# EasyEDA Pro project Jalousee PCB.eprj, schematic Jalousee PCB
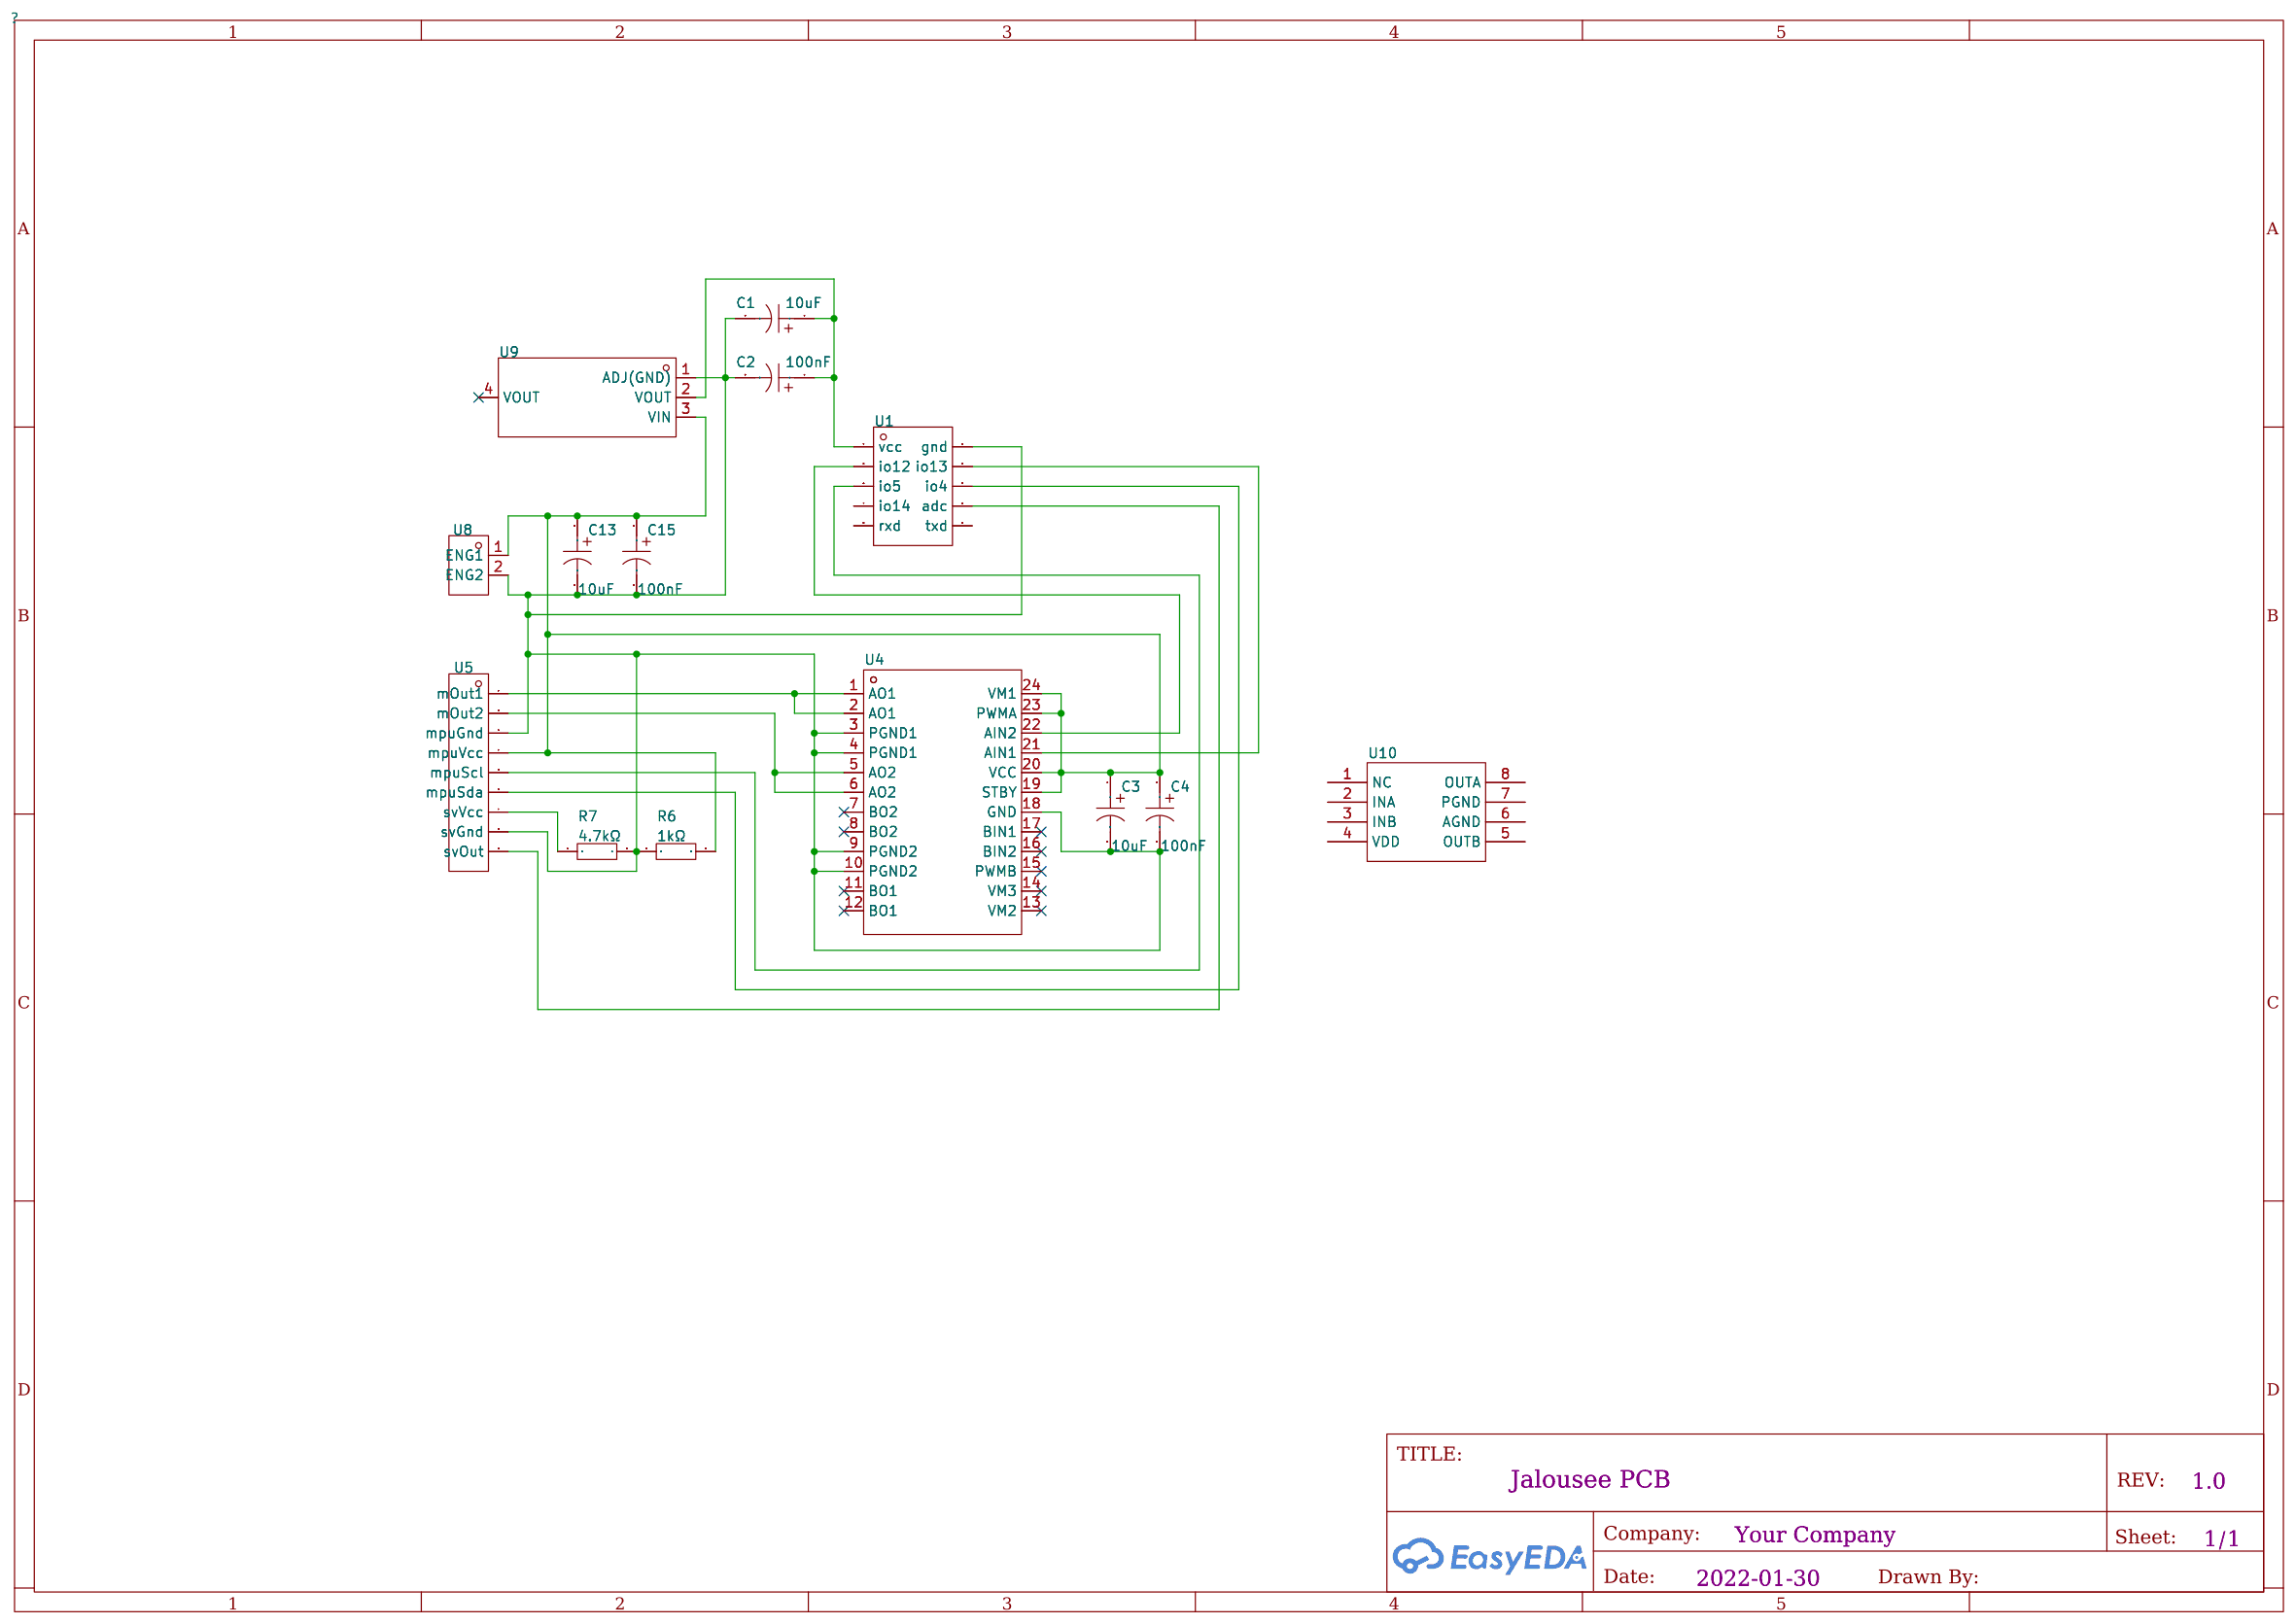
[diagram p0: schematic sheet]

## Parts
C1  10uF  [CAP-SMD_L2.0-W1.3-FD]
C2  100nF  [CAP-SMD_L3.2-W1.6-FD]
C3  10uF  [CAP-SMD_L2.0-W1.3-FD]
C4  100nF  [CAP-SMD_L3.2-W1.6-FD]
C13  10uF  [CAP-SMD_L2.0-W1.3-FD]
C15  100nF  [CAP-SMD_L3.2-W1.6-FD]
R6  1kΩ  [R0402]
R7  4.7kΩ  [R0402]
U1  -  [CONN-TH_10P-P2.54_DEALON_DW254R-22-10-85]
U4  -  [SSOP-24_L8.3-W5.6-P0.65-LS7.6-BL]
U5  -  [HDR-TH_9P-P2.54-V-F]
U8  -  [HDR-TH_2P-P2.54-V-F]
U9  -  [SOT-223-3_L6.5-W3.4-P2.30-LS7.0-BR]
U10  -  [SOP-8_L4.9-W3.9-P1.27-LS6.0-BL]

## Library data of the parts
C1 C3 C13 = CA45-P-6.3V-10UF-K: Capacitance: Tolerance:±10% Tolerance:±10% Rated Voltage: Leakage Current(DCL):- Ripple Current:- Equivalent Series Resistance(ESR):-; LCSC Part Name: 10uF ±10% 6.3V; Supplier Part: C2844395; Manufacturer: CEC(振华新云); Supplier Footprint: CASE-P_2012; JLCPCB Part Class: Extended Part; Datasheet: https://atta.szlcsc.com/upload/public/pdf/source/20210702/C2844395_E7EBF1B65FEA8FC3CE954A9FCB08EE3D.pdf; Supplier: LCSC; Tolerance: ±10%
C2 C4 C15 = T491A104M050AT: Capacitance:100nF Tolerance:±20% Tolerance:±20% Rated Voltage:50V Leakage Current(DCL):- Ripple Current:- Equivalent Series Resistance(ESR):20Ω Operating Temperature:-55~+125 Operating Temperature:-55~+125; LCSC Part Name: 100nF ±20% 50V; Supplier Part: C1952859; Manufacturer: KEMET(基美); Supplier Footprint: 1206; JLCPCB Part Class: Extended Part; Datasheet: https://atta.szlcsc.com/upload/public/pdf/source/20210416/95C0EC5B3581C9A90529545117ABEAC1.pdf; Supplier: LCSC; Tolerance: ±20%; Rated Voltage: 50V; Equivalent Series Resistance(ESR): 20Ω; Operating Temperature: -55~+125
R6 = RC0402FR-071KL: Type:厚膜电阻 Resistance:1kΩ Tolerance:±1% Power(Watts):62.5mW Temperature Coefficient:±100ppm/ Temperature Coefficient:±100ppm/ Overload Voltage (Max):50V Operating Temperature Range:-55~+155 Operating Temperature Range:-55~+155; LCSC Part Name: 1kΩ ±1%; Supplier Part: C106235; Manufacturer: YAGEO(国巨); Supplier Footprint: 0402; JLCPCB Part Class: Extended Part; Datasheet: https://atta.szlcsc.com/upload/public/pdf/source/20170518/1495085714666.pdf; Supplier: LCSC; Type: 厚膜电阻; Tolerance: ±1%; Power(Watts): 62.5mW; Temperature Coefficient: ±100ppm/; Overload Voltage (Max): 50V; Operating Temperature Range: -55~+155
R7 = RC0402FR-074K7L: Resistance: Tolerance:±1% Tolerance:±1% Power(Watts): Temperature Coefficient:±100ppm/ Temperature Coefficient:±100ppm/ Overload Voltage (Max): Operating Temperature Range:-55~+155 Operating Temperature Range:-55~+155; LCSC Part Name: 4.7kΩ ±1% 62.5mW; Supplier Part: C105871; Manufacturer: YAGEO(国巨); Supplier Footprint: 0402; JLCPCB Part Class: Extended Part; Datasheet: https://atta.szlcsc.com/upload/public/pdf/source/20170912/C105871_1505207463959963228.pdf; Supplier: LCSC; Tolerance: ±1%; Temperature Coefficient: ±100ppm/; Operating Temperature Range: -55~+155
U1 = DW254R-22-10-85: Pitch:2.54mm Number of Holes:10 Number of Rows:2 Holes Structure:2x5P Row Spacing:2.54mm Mounting Type:直插 Circular Hole / Square Hole:方孔 Current Rating (Max):3A Voltage Rating (Max):- Holes Direction:顶部 Insulation Height:8.5mm Operating Temperature Range:; LCSC Part Name: 2.54mm 2x5P; Supplier Part: C2935985; Manufacturer: DEALON(德艺隆); Supplier Footprint: 直插,P=2.54mm; JLCPCB Part Class: Extended Part; Datasheet: https://atta.szlcsc.com/upload/public/pdf/source/20211231/BFA45F732C9356EE88FA0C9F09D83196.pdf; Supplier: LCSC; Pitch: 2.54mm; Number of Holes: 10; Number of Rows: 2; Holes Structure: 2x5P; Row Spacing: 2.54mm; Mounting Type: 直插; Circular Hole / Square Hole: 方孔; Current Rating (Max): 3A; Holes Direction: 顶部; Insulation Height: 8.5mm
U4 = TB6612FNG,C,8,EL: Supplier Part: C141517; Manufacturer: TOSHIBA(东芝); Supplier Footprint: SSOP-24; JLCPCB Part Class: Extended Part; Datasheet: https://atta.szlcsc.com/upload/public/pdf/source/20171128/C141517_15118625624231147036.pdf; Supplier: LCSC
U5 = DM254R-11-09-85: Pitch:2.54mm Number of Holes:9 Number of Rows:1 Holes Structure:1x9P Row Spacing:- Mounting Type:直插 Circular Hole / Square Hole:方孔 Current Rating (Max):3A Voltage Rating (Max):- Holes Direction:顶部 Insulation Height:8.5mm Operating Temperature Range:- Oper; LCSC Part Name: 2.54mm 1x9P; Supplier Part: C2935980; Manufacturer: DEALON(德艺隆); Supplier Footprint: 直插,P=2.54mm; JLCPCB Part Class: Extended Part; Datasheet: https://atta.szlcsc.com/upload/public/pdf/source/20220110/4E97995FE1BF9788ECBB6F72A9540C3B.pdf; Supplier: LCSC; Pitch: 2.54mm; Number of Holes: 9; Number of Rows: 1; Holes Structure: 1x9P; Mounting Type: 直插; Circular Hole / Square Hole: 方孔; Current Rating (Max): 3A; Holes Direction: 顶部; Insulation Height: 8.5mm
U8 = DM254R-11-02-85: Pitch:2.54mm Number of Holes:2 Number of Rows:1 Holes Structure:1x2P Row Spacing:- Mounting Type:Straight Circular Hole / Square Hole:Square Holes Current Rating (Max):3A Voltage Rating (Max):- Holes Direction:Top Insulation Height:8.5mm Operating Tempera; LCSC Part Name: 2.54mm 1x2P 180度 Y型; Supplier Part: C2935973; Manufacturer: DEALON(德艺隆); Supplier Footprint: 直插,P=2.54mm; JLCPCB Part Class: Extended Part; Datasheet: https://atta.szlcsc.com/upload/public/pdf/source/20220110/4E97995FE1BF9788ECBB6F72A9540C3B.pdf; Supplier: LCSC; Pitch: 2.54mm; Number of Holes: 2; Number of Rows: 1; Holes Structure: 1x2P; Mounting Type: Straight; Circular Hole / Square Hole: Square Holes; Current Rating (Max): 3A; Holes Direction: Top; Insulation Height: 8.5mm
U9 = AMS1117-3.3: Output Type:固定 Output Polarity:正 Number of Outputs:1 Maximum Input Voltage:18V Output Voltage:3.3V Output Voltage:3.3V Dropout Voltage:1.3V@(1A) Output Current:1A Power Supply Rejection Ratio (PSRR):60dB@(120Hz) Operating Temperature:±150@(Tj) Operating; LCSC Part Name: Vin=18V Vout=3.3V 1A 60dB@(120Hz); Supplier Part: C2891839; Manufacturer: YONGYUTAI(永裕泰); Supplier Footprint: SOT-223; JLCPCB Part Class: Extended Part; Datasheet: https://atta.szlcsc.com/upload/public/pdf/source/20210901/A75ADDE6A17DEE0002F2A58A8D1F3634.pdf; Supplier: LCSC; Output Type: 固定; Output Polarity: 正; Number of Outputs: 1; Maximum Input Voltage: 18V; Output Voltage: 3.3V; Dropout Voltage: 1.3V@(1A); Output Current: 1A; Power Supply Rejection Ratio (PSRR): 60dB@(120Hz); Operating Temperature: ±150@(Tj)
U10 = TC118S: Supplier Part: C88308; Manufacturer: FM富满; Supplier Footprint: SOP-8_150mil; JLCPCB Part Class: Extended Part; Datasheet: https://atta.szlcsc.com/upload/public/pdf/source/20161129/1480413782462.pdf; Supplier: LCSC

## Nets
$1N39: C3.1 C4.1 C13.1 C15.1 R6.2 U4.19(STBY) U4.20(VCC) U4.23(PWMA) U4.24(VM1) U5.4(mpuVcc) U8.1(ENG1) U9.3(VIN)
$1N40: U1.4(io13) U4.21(AIN1)
$1N41: U1.3(io12) U4.22(AIN2)
$1N43: U4.1(AO1) U4.2(AO1) U5.1(mOut1)
$1N44: U4.5(AO2) U4.6(AO2) U5.2(mOut2)
$1N47: U1.6(io4) U5.6(mpuSda)
$1N57: C1.2 C2.2 C3.2 C4.2 C13.2 C15.2 R6.1 R7.2 U1.2(gnd) U4.3(PGND1) U4.4(PGND1) U4.9(PGND2) U4.10(PGND2) U4.18(GND) U5.3(mpuGnd) U5.8(svGnd) U8.2(ENG2) U9.1(ADJ(GND))
$1N58: R7.1 U5.7(svVcc)
$1N59: U1.8(adc) U5.9(svOut)
$1N28414: C1.1 C2.1 U1.1(vcc) U9.2(VOUT)
$1N29819: U1.5(io5) U5.5(mpuScl)

Not connected (* = marked no-connect by the designer): U1 7(io14) 9(rxd) 10(txd); U4 7(BO2)* 8(BO2)* 11(BO1)* 12(BO1)* 13(VM2)* 14(VM3)* 15(PWMB)* 16(BIN2)* 17(BIN1)*; U9 4(VOUT)*; U10 1(NC) 2(INA) 3(INB) 4(VDD) 5(OUTB) 6(AGND) 7(PGND) 8(OUTA)
